# EAGLE schematic controller (EAGLE 8.0.1)

## Sheet 1 of 2: supply
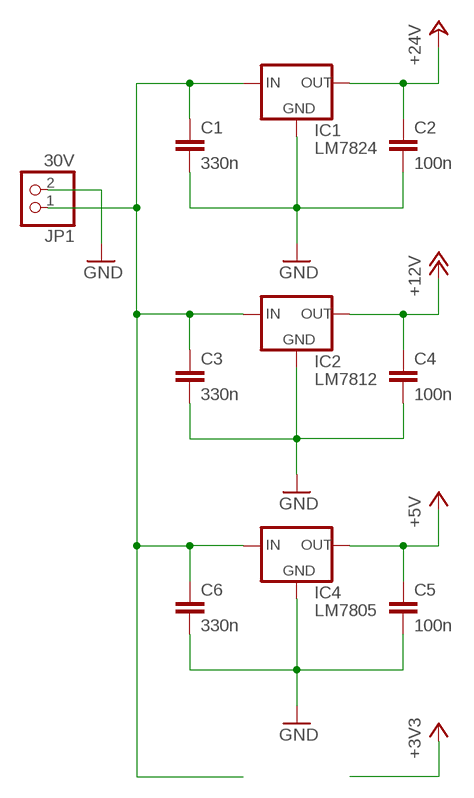
[diagram p0: schematic, sheet 1]

### Parts
C1  330n  C-EU050-024X044  [C050-024X044]
C2  100n  C-EU050-024X044  [C050-024X044]
C3  330n  C-EU050-024X044  [C050-024X044]
C4  100n  C-EU050-024X044  [C050-024X044]
C5  100n  C-EU050-024X044  [C050-024X044]
C6  330n  C-EU050-024X044  [C050-024X044]
IC1  LM7824  78XXS  [78XXS]
IC2  LM7812  78XXS  [78XXS]
IC4  LM7805  78XXS  [78XXS]
JP1  30V  PINHD-1X2  [1X02]

### Nets
+5V: C5.1 IC4.OUT ; also sheet 2
+12V: C4.1 IC2.OUT
+24V: C2.1 IC1.OUT
GND: C1.2 C2.2 C3.2 C4.2 C5.2 C6.2 IC1.GND IC2.GND IC4.GND JP1.2 ; also sheet 2
N$1: C1.1 C3.1 C6.1 IC1.IN IC2.IN IC4.IN JP1.1

## Sheet 2 of 2
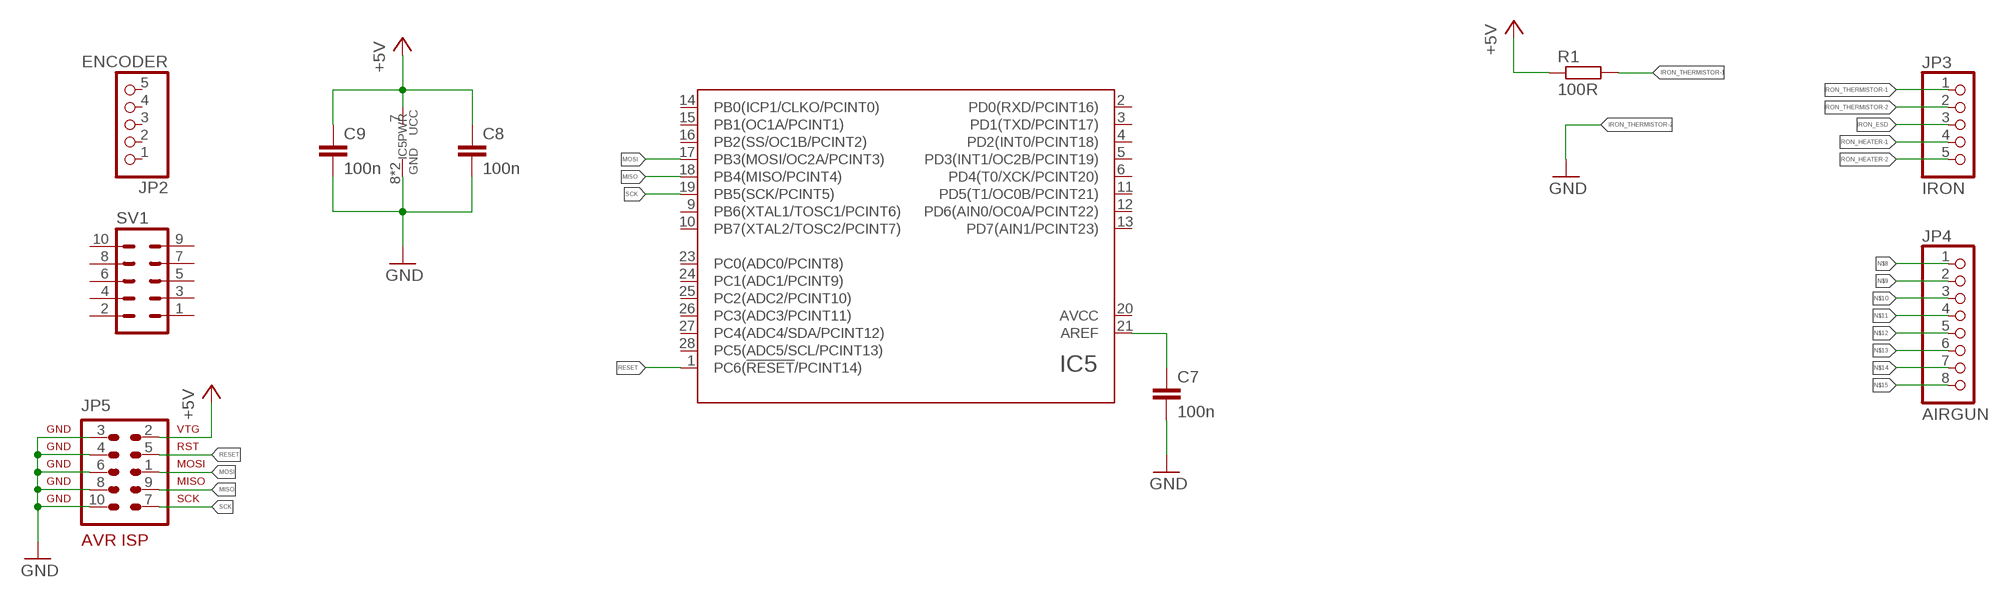
[diagram p1: schematic, sheet 2]

### Parts
C7  100n  C-EU050-024X044  [C050-024X044]
C8  100n  C-EU050-024X044  [C050-024X044]
C9  100n  C-EU050-024X044  [C050-024X044]
IC5  ATMEGA48/88/168/328-PU(DIP28)PU  [DIL28]
JP2  ENCODER  PINHD-1X5  [1X05]
JP3  IRON  PINHD-1X5  [1X05]
JP4  AIRGUN  PINHD-1X8  [1X08]
JP5  AVR-ISP-10  [AVR-ISP-10]
R1  100R  R-EU_0204/5  [0204/5]
SV1  ML10  [ML10]

### Nets
+5V: C8.1 C9.1 IC5.7(UCC) JP5.2 R1.1 ; also sheet 1
GND: C7.2 C8.2 C9.2 IC5.8(GND) IC5.22(GND) JP5.3 JP5.4 JP5.6 JP5.8 JP5.10 ; also sheet 1
IRON_ESD: JP3.3
IRON_HEATER-1: JP3.4
IRON_HEATER-2: JP3.5
IRON_THERMISTOR-1: JP3.1 R1.2
IRON_THERMISTOR-2: JP3.2 ; supply symbol labelled GND
MISO: IC5.18(PB4(MISO/PCINT4)) JP5.9
MOSI: IC5.17(PB3(MOSI/OC2A/PCINT3)) JP5.1
N$2: C7.1 IC5.21(AREF)
N$8: JP4.1
N$9: JP4.2
N$10: JP4.3
N$11: JP4.4
N$12: JP4.5
N$13: JP4.6
N$14: JP4.7
N$15: JP4.8
RESET: IC5.1(PC6(!RESET!/PCINT14)) JP5.5
SCK: IC5.19(PB5(SCK/PCINT5)) JP5.7
Unconnected: IC5.2(PD0(RXD/PCINT16)) IC5.3(PD1(TXD/PCINT17)) IC5.4(PD2(INT0/PCINT18)) IC5.5(PD3(INT1/OC2B/PCINT19)) IC5.6(PD4(T0/XCK/PCINT20)) IC5.9(PB6(XTAL1/TOSC1/PCINT6)) IC5.10(PB7(XTAL2/TOSC2/PCINT7)) IC5.11(PD5(T1/OC0B/PCINT21)) IC5.12(PD6(AIN0/OC0A/PCINT22)) IC5.13(PD7(AIN1/PCINT23)) IC5.14(PB0(ICP1/CLKO/PCINT0)) IC5.15(PB1(OC1A/PCINT1)) IC5.16(PB2(SS/OC1B/PCINT2)) IC5.23(PC0(ADC0/PCINT8)) IC5.24(PC1(ADC1/PCINT9)) IC5.25(PC2(ADC2/PCINT10)) IC5.26(PC3(ADC3/PCINT11)) IC5.27(PC4(ADC4/SDA/PCINT12)) IC5.28(PC5(ADC5/SCL/PCINT13)) JP2.1 JP2.2 JP2.3 JP2.4 JP2.5 SV1.1 SV1.2 SV1.3 SV1.4 SV1.5 SV1.6 SV1.7 SV1.8 SV1.9 SV1.10

## Power pins joined to a net without a drawn wire
AVCC: IC5.20(AVCC)

## Library data of the parts
C1-C9 = rcl:C-EU: CAPACITOR, European symbol
IC1 IC2 IC4 = v-reg:78XXS: VOLTAGE REGULATOR
IC5 = atmel_tiny24-44-84tiny48-88mega48-88-168-328:ATMEGA48/88/168/328-PU(DIP28)
JP1 = pinhead:PINHD-1X2: PIN HEADER
JP2 JP3 = pinhead:PINHD-1X5: PIN HEADER
JP4 = pinhead:PINHD-1X8: PIN HEADER
JP5 = atmel:AVR-ISP-10: AVR ISP-10 Serial Programming Header
R1 = rcl:R-EU_: RESISTOR, European symbol
SV1 = con-harting-ml:ML10: HARTING; OC_FARNELL: unknown; OC_NEWARK: unknown